# EAGLE design led-controller-board (EAGLE 7.7.0)
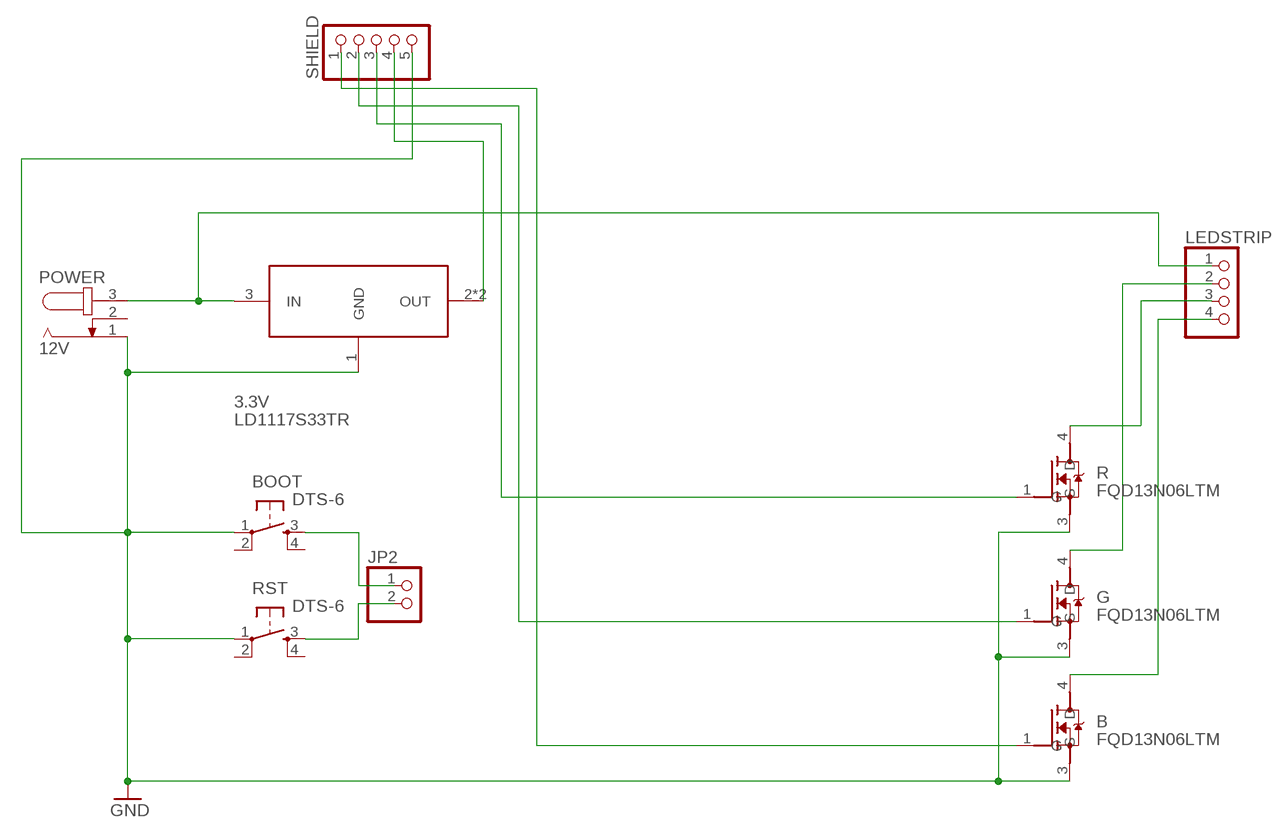
[diagram p0: schematic, sheet 1]

## Parts
3.3V  LD1117S33TR  [SOT223]
B  FQD13N06LTM  [TO229P991X239-3N]
BOOT  DTS-6  [DTS-6]
G  FQD13N06LTM  [TO229P991X239-3N]
JP2  PINHD-1X2  [1X02]
LEDSTRIP  PINHD-1X4/90  [1X04/90]
POWER  12V  JACK-PLUG1  [SPC4078]
R  FQD13N06LTM  [TO229P991X239-3N]
RST  DTS-6  [DTS-6]
SHIELD  PINHD-1X5  [1X05]

## Nets
GND: 3.3V.1(GND) B.3(S) BOOT.1 G.3(S) POWER.1 R.3(S) RST.1 SHIELD.5
N$1: 3.3V.3(IN) LEDSTRIP.1 POWER.3
N$2: BOOT.3 JP2.1
N$3: JP2.2 RST.3
N$4: 3.3V.2(OUT) 3.3V.4(OUT) SHIELD.4
N$5: B.1(G) SHIELD.1
N$10: R.1(G) SHIELD.3
N$11: G.1(G) SHIELD.2
N$12: G.4(D) LEDSTRIP.2
N$13: LEDSTRIP.3 R.4(D)
N$14: B.4(D) LEDSTRIP.4
Unconnected: BOOT.2 BOOT.4 POWER.2 RST.2 RST.4

## Library data of the parts
3.3V = LD1117S33TR:LD1117S33TR: http://octopart.com/ld1117s33tr-stmicroelectronics-526708; AVAILABILITY: Good; DESCRIPTION: LD1117 Series 1300 mA 3.3 V Fixed Output Positive Voltage LDO Regulator- SOT-223; MF: STMicroelectronics; MP: LD1117S33TR; PACKAGE: SOT-223 STMicroelectronics; PRICE: 0.21 USD
B G R = FQD13N06LTM:FQD13N06LTM: FQD13N06L Series 60 V 0.115 Ohm Surface Mount LOGIC N-Channel Mosfet - TO-252-3; AVAILABILITY: Good; DESCRIPTION: FQD13N06L Series 60 V 0.115 Ohm Surface Mount LOGIC N-Channel Mosfet - TO-252-3; MF: Fairchild Semiconductor; MP: FQD13N06LTM; PACKAGE: TO-252-3 Fairchild Semiconductor; PRICE: 0.43 USD
BOOT RST = switch-tact:DTS-6
JP2 = pinhead:PINHD-1X2: PIN HEADER
LEDSTRIP = pinhead:PINHD-1X4: PIN HEADER
POWER = con-jack:JACK-PLUG: DC POWER JACK Power Jack, DC, Right Angle, Through Hole, Rated 5A at 16VDC, PC Terminals Distributor: Farnell (www.Farnell.de) Drawing: 84N1161.pdf / 84N1162.pdf Manufacturer: SPC Technology (www.spctechnology.com) Type: SPC4077 / SPC 4078; OC_FARNELL: unknown; OC_NEWARK: unknown
SHIELD = pinhead:PINHD-1X5: PIN HEADER

## Board
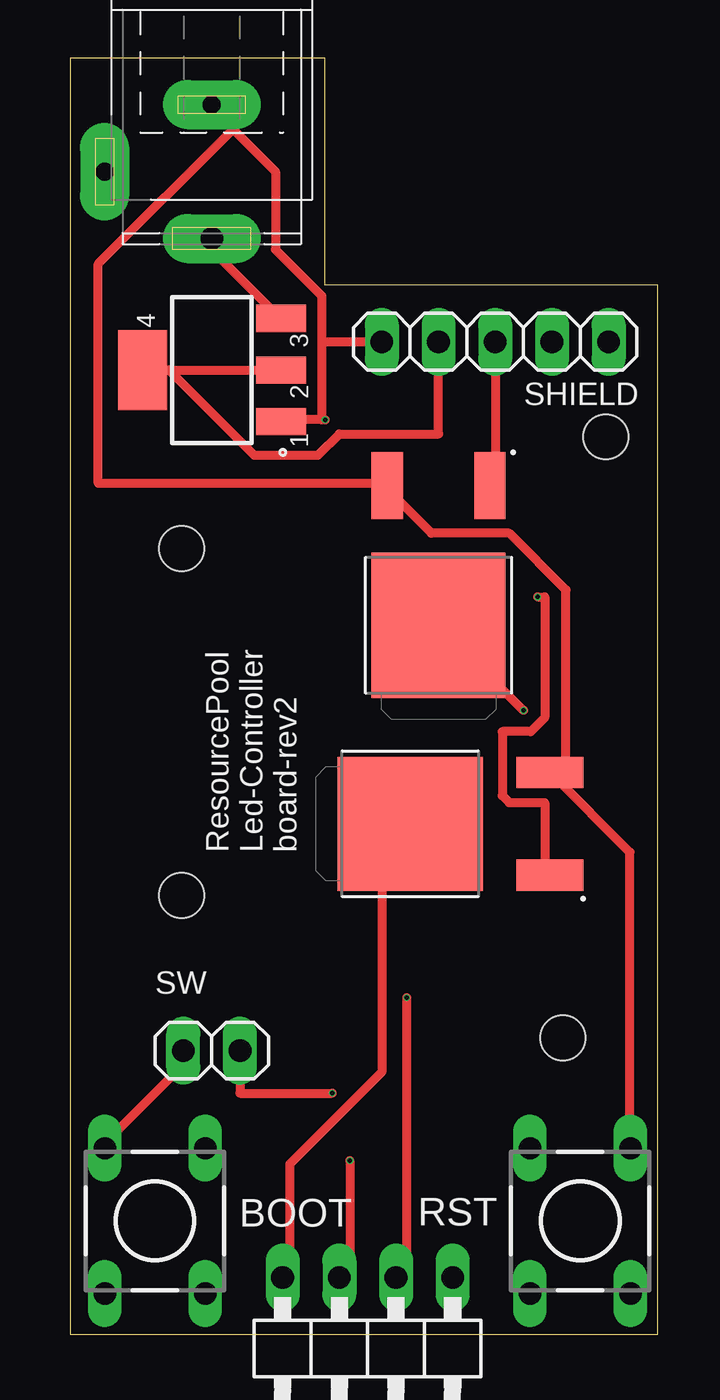
[diagram p1: board, top side]
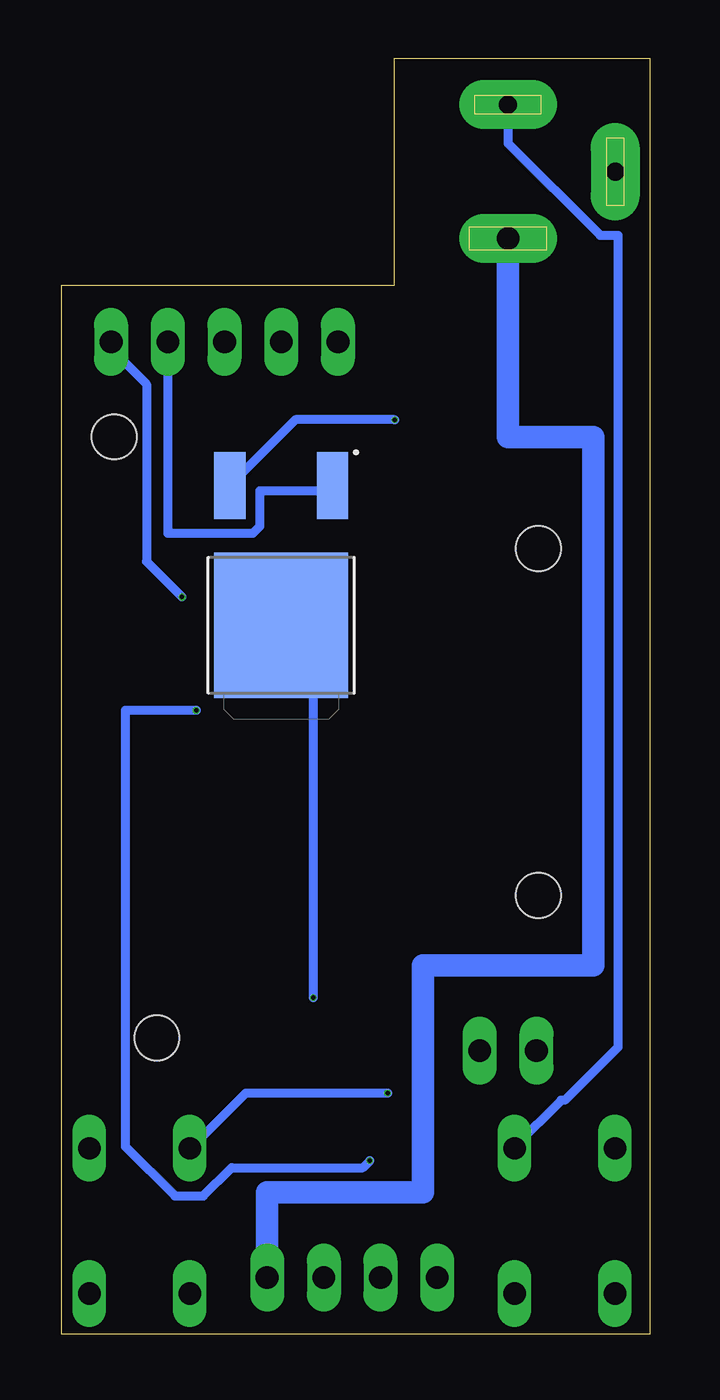
[diagram p2: board, bottom side, seen from below]

Size 26.34 x 57.14 mm. Coordinates in mm from the lower left corner, seen from the top.
Outline: 0,0 26.34,0 26.34,46.98 11.43,46.99 11.43,57.14 0,57.14 0,0
Copper layers (1*16): Top 0.035mm / dielectric 1.5mm / Bottom 0.035mm
Design rules "aisler_go_2layer *": minimum track width 0.4mm, minimum drill 0.2mm, track to track 0.4mm, track to pad 0.4mm, pad to pad 0.4mm, via to via 0.2mm, smd to smd 0.1mm, copper to edge 0.2mm, drill to drill 0.21mm, minimum pad ring 0.25mm, minimum via ring 0.05mm, stop-mask expansion 0.01mm, vias tented up to drill 0mil, thermal gap 10mil
Holes 2 mm at 5,35.19 5,19.65 22.08,13.27 24,40.19

### Footprints (pad centres in the part's own frame; a part is rotated, then mirrored left to right if it is on the bottom)
SOT223 = smd 2.235 x 1.219: 1 -3.099,2.311; 2 -3.099,0; 3 -3.099,-2.311 | smd 2.2 x 3.6: 4 3.099,0
TO229P991X239-3N = smd 1.4 x 3: 1 -2.3,-6.25; 3 2.3,-6.25 | smd 6 x 6.5: 4 0,0
DTS-6 = drill 1 long: 1 -3.25,2.25; 2 3.25,2.25; 3 -3.25,-2.25; 4 3.25,-2.25
1X02 = drill 1.016 long: 1 -1.27,0; 2 1.27,0
1X04/90 = drill 1.016 long: 1 -3.81,-3.81; 2 -1.27,-3.81; 3 1.27,-3.81; 4 3.81,-3.81
SPC4078 = drill 0.8 pad 2.184 long: 1 -3,0; 2 0,-4.8 | drill 1 pad 2.184 long: 3 3,0
1X05 = drill 1.016 long: 1 -5.08,0; 2 -2.54,0; 3 0,0; 4 2.54,0; 5 5.08,0

### Placement (x,y rotation side)
3.3V  6.35,43.18 180 top
B  15.24,22.86 90 top
BOOT  3.81,5.08 270 top
G  16.51,31.75 180 bottom
JP2  6.35,12.7 0 top
LEDSTRIP  13.34,-1.27 180 top
POWER  6.35,52.07 270 top
R  16.51,31.75 180 top
RST  22.86,5.08 270 top
SHIELD  19.05,44.45 180 top

### Tracks (layer width: path | path; a pad name or v marks a point on that pad's centre or on a via)
GND  (via drill 0.2)
  Top 0.4: RST.1 25.08,8.41 25.08,21.59 21.59,25.08 B.3 21.59,25.4 22.23,25.4 22.23,33.34 19.68,35.88 16.19,35.88 14.29,37.78 R.3 13.97,38.1 1.27,38.1 1.27,47.94 7.3,53.97 | 11.27,40.96 9.53,40.96 3.3V.1 | 11.27,44.45 11.27,46.51 9.21,48.58 9.21,52.07 7.3,53.97 | 11.27,44.45 11.27,40.96 | 7.3,53.97 6.35,54.93 POWER.1 | v11.43,40.96 11.27,40.96 | 11.27,44.45 SHIELD.5
  Bottom 0.4: POWER.1 6.35,53.34 2.22,49.21 1.43,49.21 1.43,12.86 3.81,10.48 3.97,10.48 6.03,8.41 BOOT.1 | v11.43,40.96 15.88,40.96 18.73,38.1 G.3
N$1
  Top 0.4: POWER.3 6.35,48.58 9.37,45.56 3.3V.3
  Bottom 1.016: POWER.3 6.35,40.18 2.54,40.18 2.54,16.51 10.16,16.51 10.16,6.35 17.14,6.35 LEDSTRIP.1
N$2
  Top 0.4: JP2.1 5.08,12.06 1.59,8.57 BOOT.3
N$3  (via drill 0.2)
  Top 0.4: v11.75,10.79 7.62,10.79 JP2.2
  Bottom 0.4: v11.75,10.79 18.1,10.79 20.32,8.57 RST.3
N$4
  Top 0.4: 3.3V.4 4.45,43.18 | 4.45,43.18 3.3V.2 | SHIELD.4 16.51,40.32 12.06,40.32 11.11,39.37 8.26,39.37 4.45,43.18
N$5  (via drill 0.2)
  Top 0.4: v20.95,33.02 21.27,33.02 21.27,27.62 20.64,26.99 19.37,26.99 19.37,24.13 19.68,23.81 21.27,23.81 21.27,20.64 B.1
  Bottom 0.4: v20.95,33.02 22.54,34.61 22.54,42.54 24.13,44.13 SHIELD.1
N$10
  Top 0.4: SHIELD.3 19.05,38.1 R.1
N$11
  Bottom 0.4: SHIELD.2 21.59,35.88 17.78,35.88 17.46,36.2 17.46,37.78 14.29,37.78 G.1
N$12  (via drill 0.2)
  Top 0.4: LEDSTRIP.2 15.08,3.65 v15.08,15.08
  Bottom 0.4: v15.08,15.08 15.08,31.75 G.4
N$13  (via drill 0.2)
  Top 0.4: LEDSTRIP.3 12.54,3.65 v12.54,7.78 | R.4 v20.32,27.94
  Bottom 0.4: v12.54,7.78 12.86,7.46 18.73,7.46 20,6.19 21.27,6.19 23.5,8.41 23.5,27.94 v20.32,27.94
N$14
  Top 0.4: LEDSTRIP.4 9.84,3.49 9.84,7.62 13.97,11.75 13.97,21.59 B.4

### Text on the board
tNames: ResourcePool / Led-Controller / board-rev2 | SW